# EAGLE design MiniPowerAdaptor (EAGLE 6.6.0)
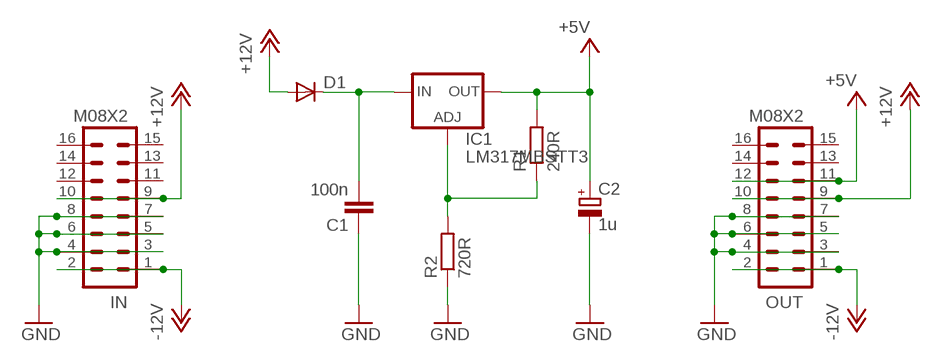
[diagram p0: schematic, sheet 1]

## Parts
C1  100n  C-EUC0603  [C0603]
C2  1u  CPOL-EUSANYO_SMD_A5  [SANYO-OSCON_SMD_A5]
D1  DIODESMA  [SMA-DIODE]
IC1  LM317MBSTT3  [SOT223]
IN  M08X2  [2X8]
OUT  M08X2  [2X8]
R1  240R  R-EU_0603  [0603]
R2  720R  R-EU_0603  [0603]

## Nets
+5V: C2.+ IC1.4(OUT) OUT.11 OUT.12 R1.2
+12V: D1.A IN.9 IN.10 OUT.9 OUT.10
-12V: IN.1 IN.2 OUT.1 OUT.2
GND: C1.1 C2.- IN.3 IN.4 IN.5 IN.6 IN.7 IN.8 OUT.3 OUT.4 OUT.5 OUT.6 OUT.7 OUT.8 R2.1
N$1: IC1.1(ADJ) R1.1 R2.2
N$3: C1.2 D1.C IC1.3(IN)
Unconnected: IN.11 IN.12 IN.13 IN.14 IN.15 IN.16 OUT.13 OUT.14 OUT.15 OUT.16

## Library data of the parts
C1 = rcl:C-EU: CAPACITOR, European symbol
C2 = rcl:CPOL-EU: POLARIZED CAPACITOR, European symbol
D1 = SparkFun:DIODE: Diode These are standard reverse protection diodes and small signal diodes. SMA package can handle up to about 1A. SOD-323 can handle about 200mA. What the SOD-323 package when ordering, there are some mfgs out there that are 5-pin packages.
IC1 = v-reg:LM317?*: 500 mA Adjustable Output Positive Voltage Regulator Source: http://www.onsemi.co.jp .. LM317M-D.PDF
IN OUT = SparkFun:M08X2
R1 R2 = Rebel:R-EU_: RESISTOR, European symbol

## Board
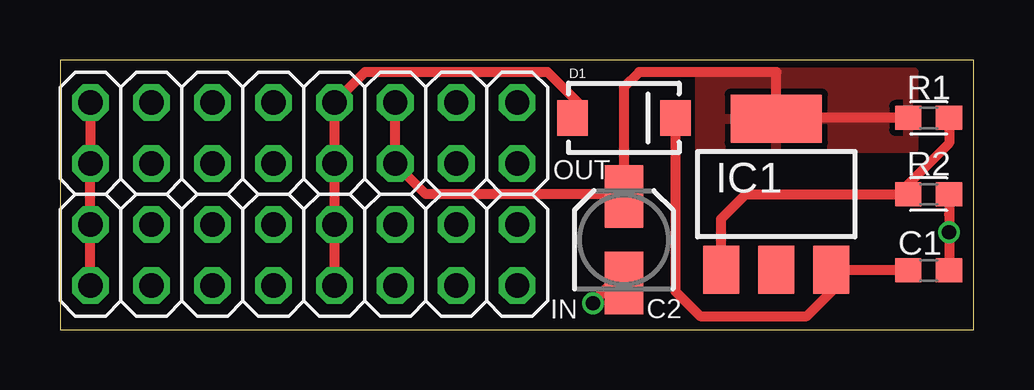
[diagram p1: board, top side]
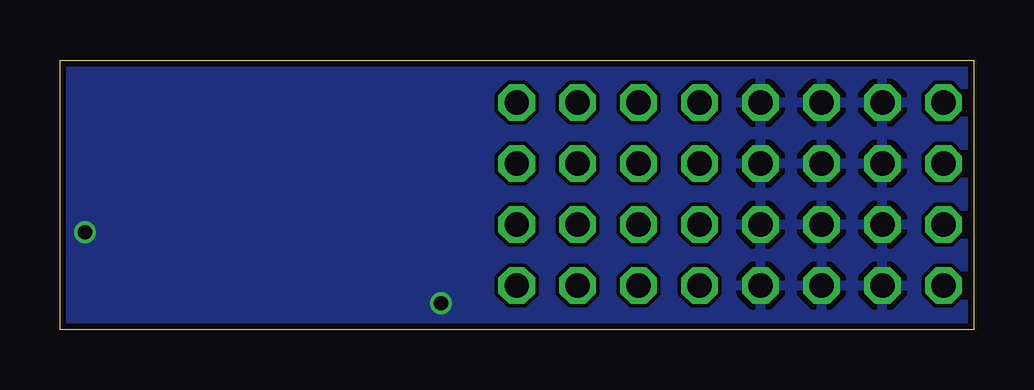
[diagram p2: board, bottom side, seen from below]

Size 38.08 x 11.24 mm. Coordinates in mm from the lower left corner, seen from the top.
Outline: 0,0 38.08,0 38.08,11.24 0,11.24 0,0
Copper layers (1*16): Top 0.035mm / dielectric 1.5mm / Bottom 0.035mm
Design rules "Rebel *": minimum track width 6mil, minimum drill 12mil, track to track 6mil, track to pad 6mil, pad to pad 6mil, via to via 6mil, smd to smd 0mil, copper to edge 10mil, drill to drill 10mil, minimum pad ring 10mil, minimum via ring 6mil, stop-mask expansion 2mil, vias tented up to drill 100mil, thermal gap 10mil

### Footprints (pad centres in the part's own frame; a part is rotated, then mirrored left to right if it is on the bottom)
C0603 = smd 1.1 x 1: 1 -0.85,0; 2 0.85,0
SANYO-OSCON_SMD_A5 = smd 2.6 x 1.6: + 1.8,0; - -1.8,0
SMA-DIODE = smd 1.27 x 1.47: A -2.15,0; C 2.15,0
SOT223 = smd 1.5 x 2: 1 -2.3,-3.15; 2 0,-3.15; 3 2.3,-3.15 | smd 3.8 x 2: 4 0,3.15
2X8 = drill 1.016 octagon: 1 0,0; 2 0,2.54; 3 2.54,0; 4 2.54,2.54; 5 5.08,0; 6 5.08,2.54; 7 7.62,0; 8 7.62,2.54; 9 10.16,0; 10 10.16,2.54; 11 12.7,0; 12 12.7,2.54; 13 15.24,0; 14 15.24,2.54; 15 17.78,0; 16 17.78,2.54
0603 = smd 1.1 x 1: 1 -0.85,0; 2 0.85,0

### Placement (x,y rotation side)
C1  36.2,2.48 180 top
C2  23.5,3.75 90 top
D1  23.5,8.83 0 top
IC1  29.84,5.65 0 top
IN  1.27,1.84 0 top
OUT  1.27,6.92 0 top
R1  36.2,8.83 180 top
R2  36.2,5.65 180 top

### Tracks (layer width: path | path; a pad name or v marks a point on that pad's centre or on a via)
+5V
  Top 0.406: R1.2 29.87,8.83 IC1.4 29.84,10.73 24.13,10.73 23.5,10.1 C2.+ 23.39,5.65 15.24,5.65 OUT.11 OUT.12
  pour Top: 26.67,10.73 35.56,10.73 35.56,7.56 26.67,7.56
+12V
  Top 0.406: D1.A 21.59,9.46 20.32,10.73 12.7,10.73 OUT.10 OUT.9 IN.10 IN.9
-12V
  Top 0.406: OUT.2 OUT.1 IN.2 IN.1
GND  (via drill 0.6)
  Top 0.406: C1.1 R2.1 37.04,4.8 v37.04,4.06 | C2.- 22.96,1.95 v22.21,1.11
  pour Bottom: 0,11.37 0,-0.06 38.1,-0.06 38.1,11.37
N$1
  Top 0.406: IC1.1 27.55,4.62 28.57,5.65 R2.2 35.34,6.07 37.04,7.77 R1.1
N$3
  Top 0.406: D1.C 25.64,1.6 26.67,0.57 31.11,0.57 32.38,1.84 32.38,2.26 IC1.3 35.32,2.5 C1.2

### Text on the board
Document: RT MINIPWR RV1